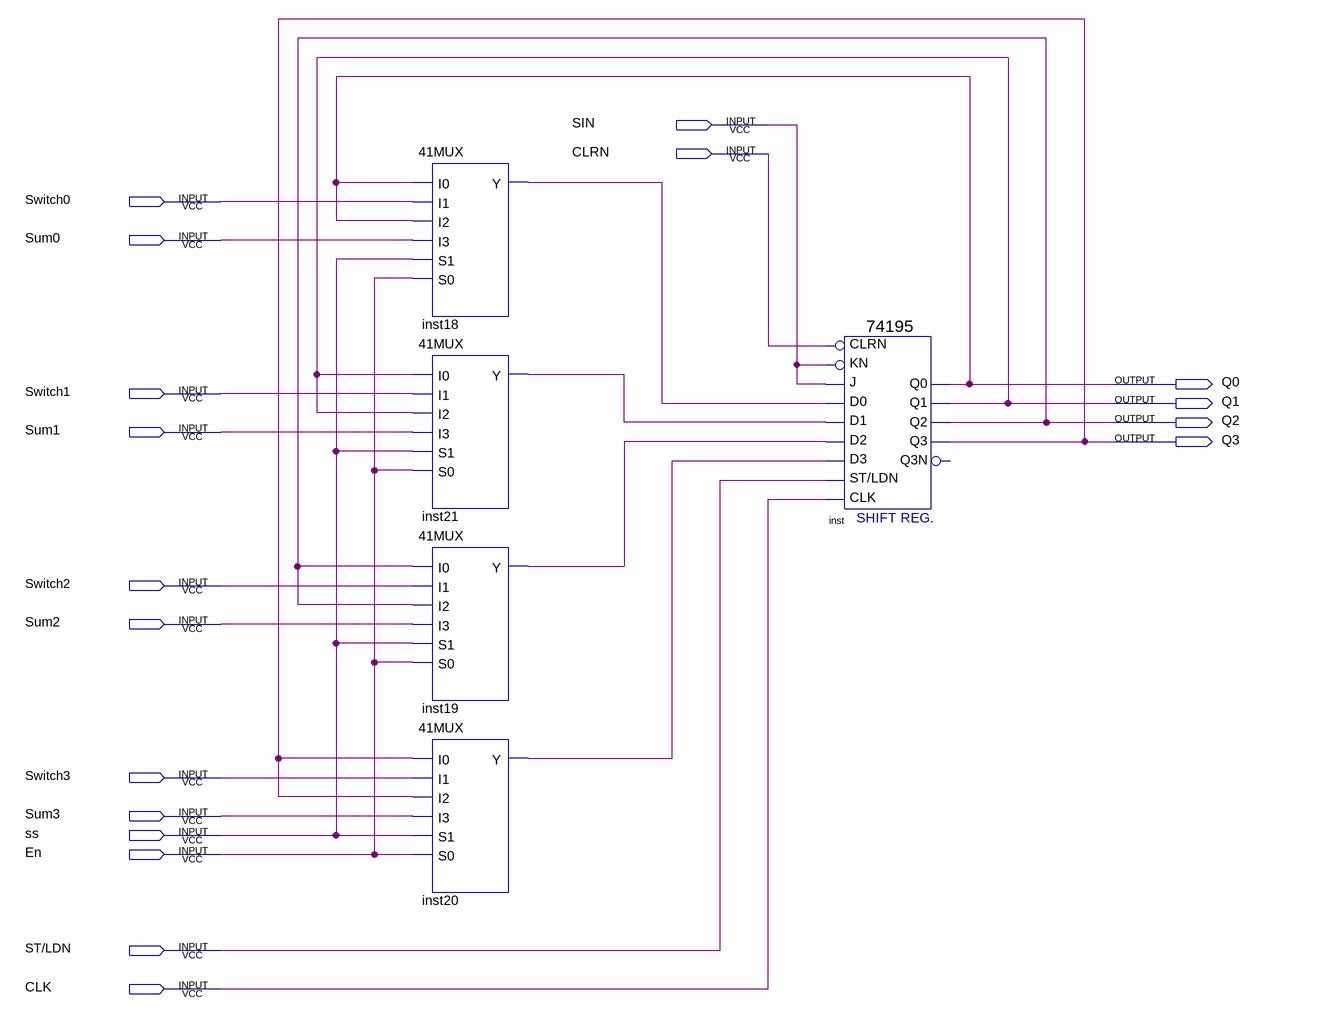
[diagram p0: schematic sheet]
// Quartus schematic Register.bdf as structural Verilog: 5 symbols, 18 pins
module Register (
  input  SIN,
  input  CLRN,
  input  Switch0,
  input  Sum0,
  input  Switch1,
  input  Sum1,
  input  Switch2,
  input  Sum2,
  input  Switch3,
  input  Sum3,
  input  ss,
  input  En,
  input  \ST/LDN ,
  input  CLK,
  output Q0,
  output Q1,
  output Q2,
  output Q3
);

  wire inst18_y, inst19_y, inst20_y, inst21_y;

  \41MUX  inst18 (.I0(Q0), .I1(Switch0), .I2(Q0), .I3(Sum0), .S1(ss), .S0(En), .Y(inst18_y));
  \41MUX  inst21 (.I0(Q1), .I1(Switch1), .I2(Q1), .I3(Sum1), .S1(ss), .S0(En), .Y(inst21_y));
  \41MUX  inst19 (.I0(Q2), .I1(Switch2), .I2(Q2), .I3(Sum2), .S1(ss), .S0(En), .Y(inst19_y));
  \41MUX  inst20 (.I0(Q3), .I1(Switch3), .I2(Q3), .I3(Sum3), .S1(ss), .S0(En), .Y(inst20_y));
  \74195  inst (
    .\ST/LDN (\ST/LDN ), .KN(SIN), .CLRN(CLRN), .D2(inst19_y), .D1(inst21_y), .D0(inst18_y), .J(SIN),
    .CLK(CLK), .D3(inst20_y), .Q3(Q3), .Q0(Q0), .Q1(Q1), .Q2(Q2));  // open: Q3N
endmodule
